# Altium schematic sheet Top_Level.SchDoc
size D
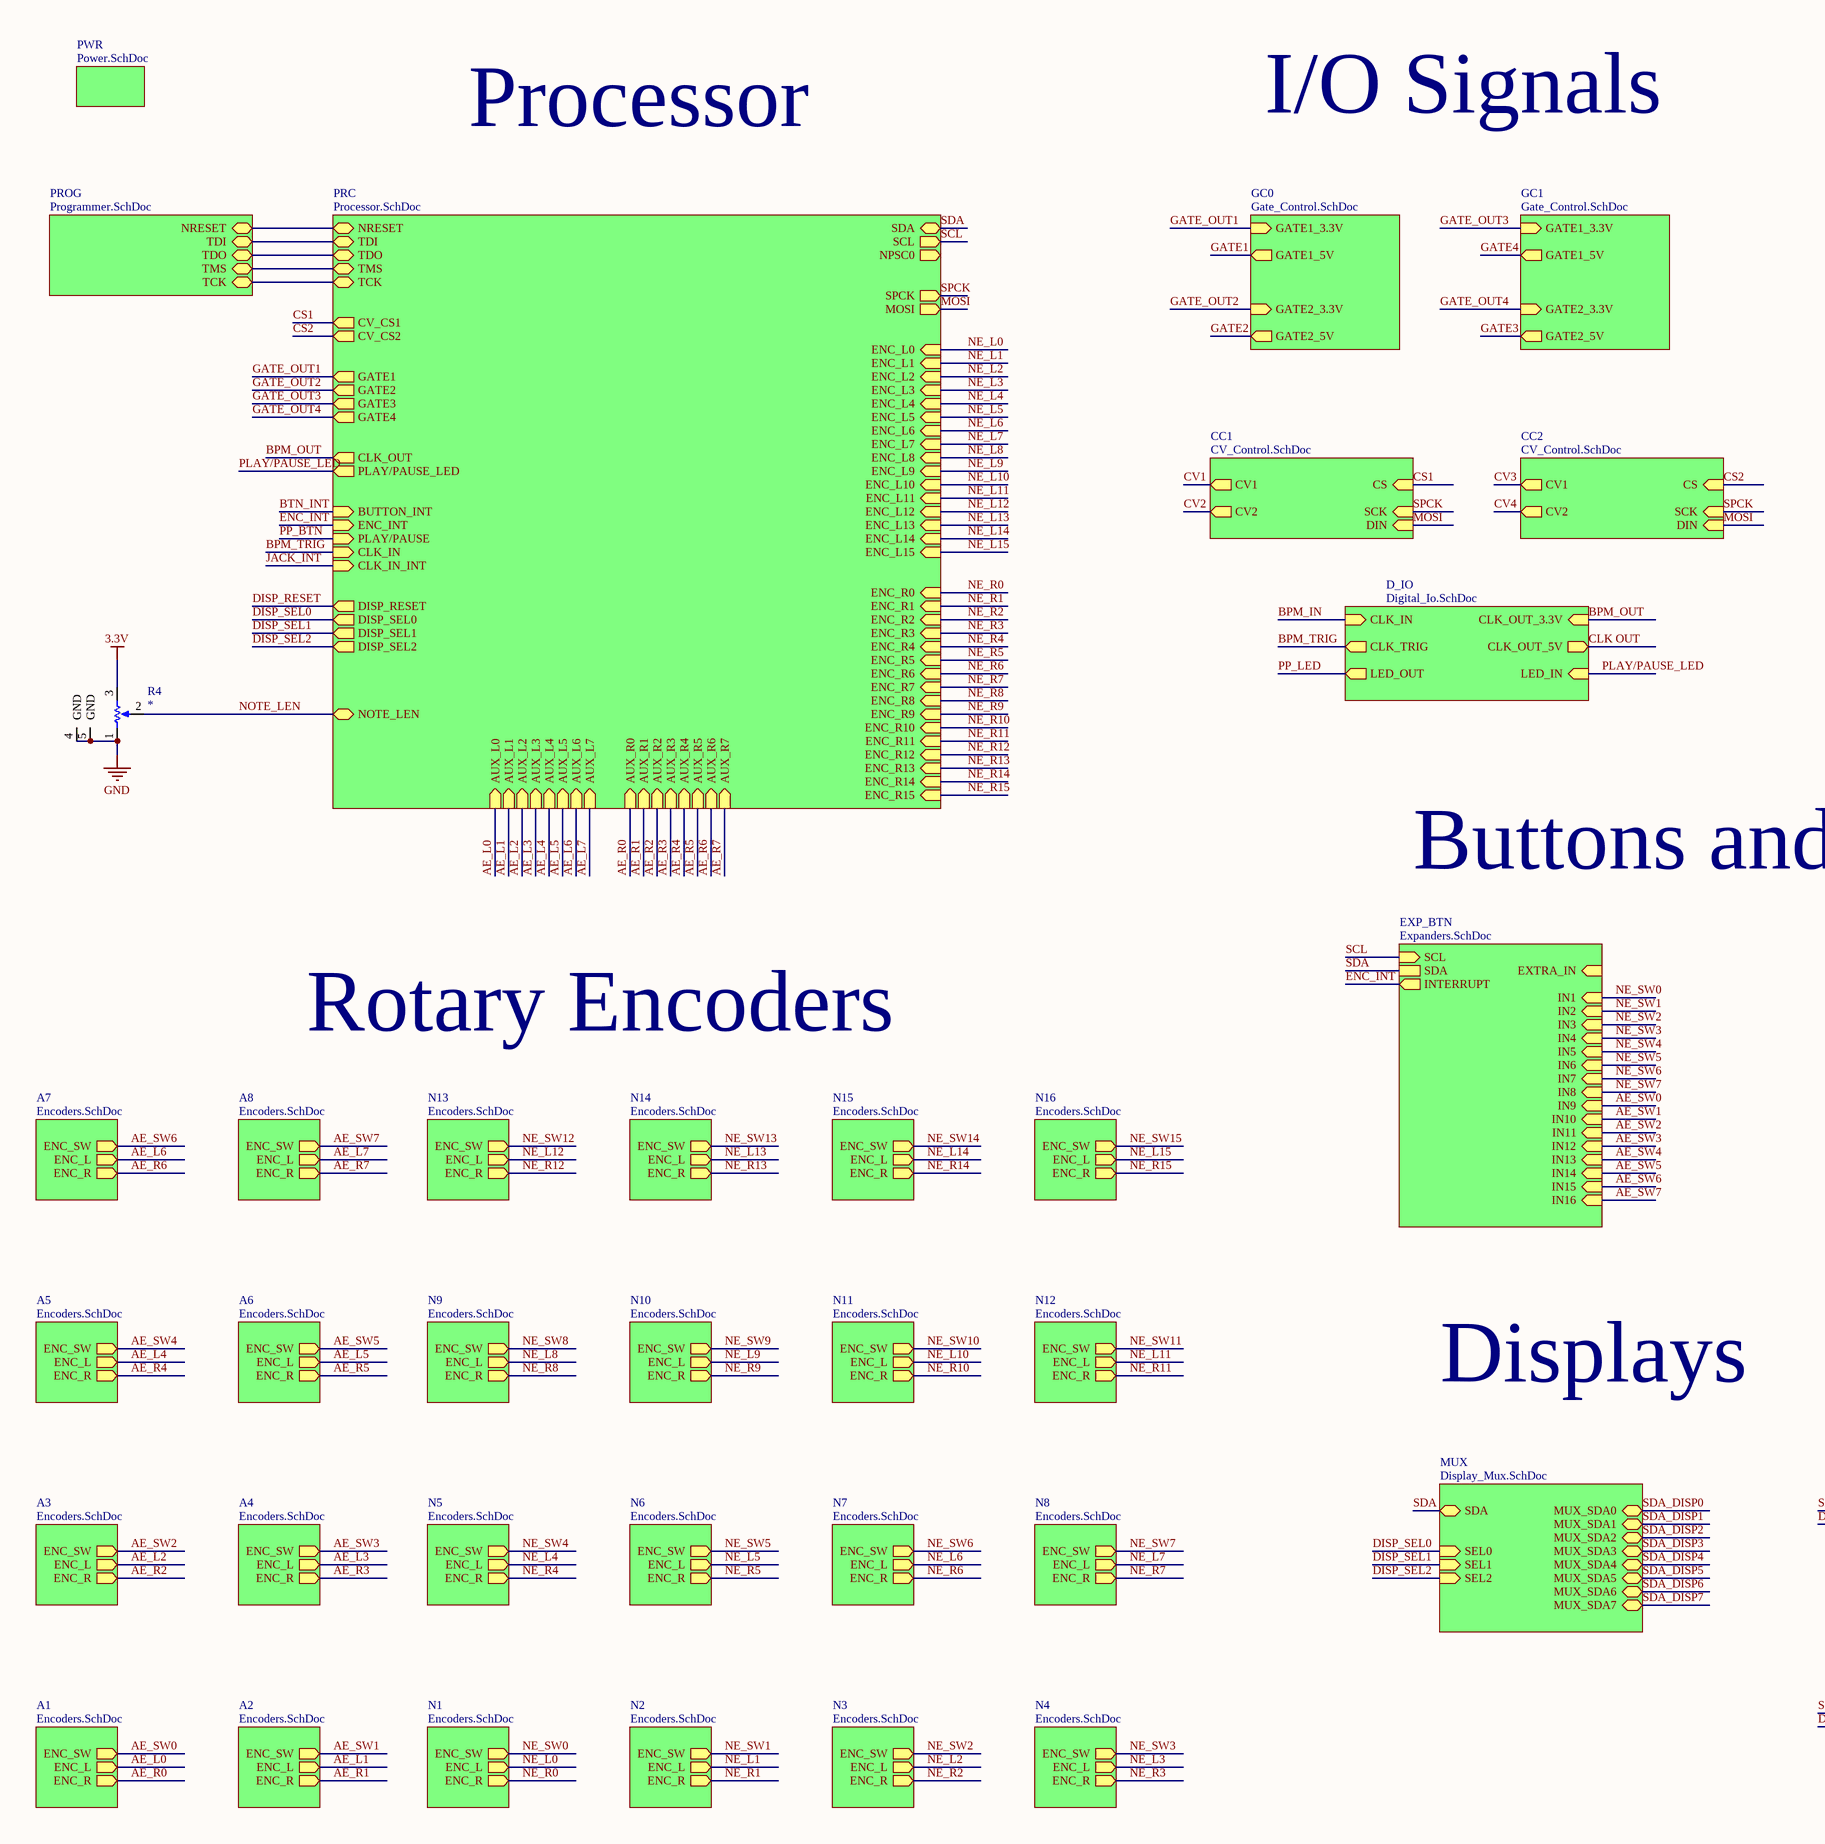
[diagram p0: Top_Level.SchDoc, left]
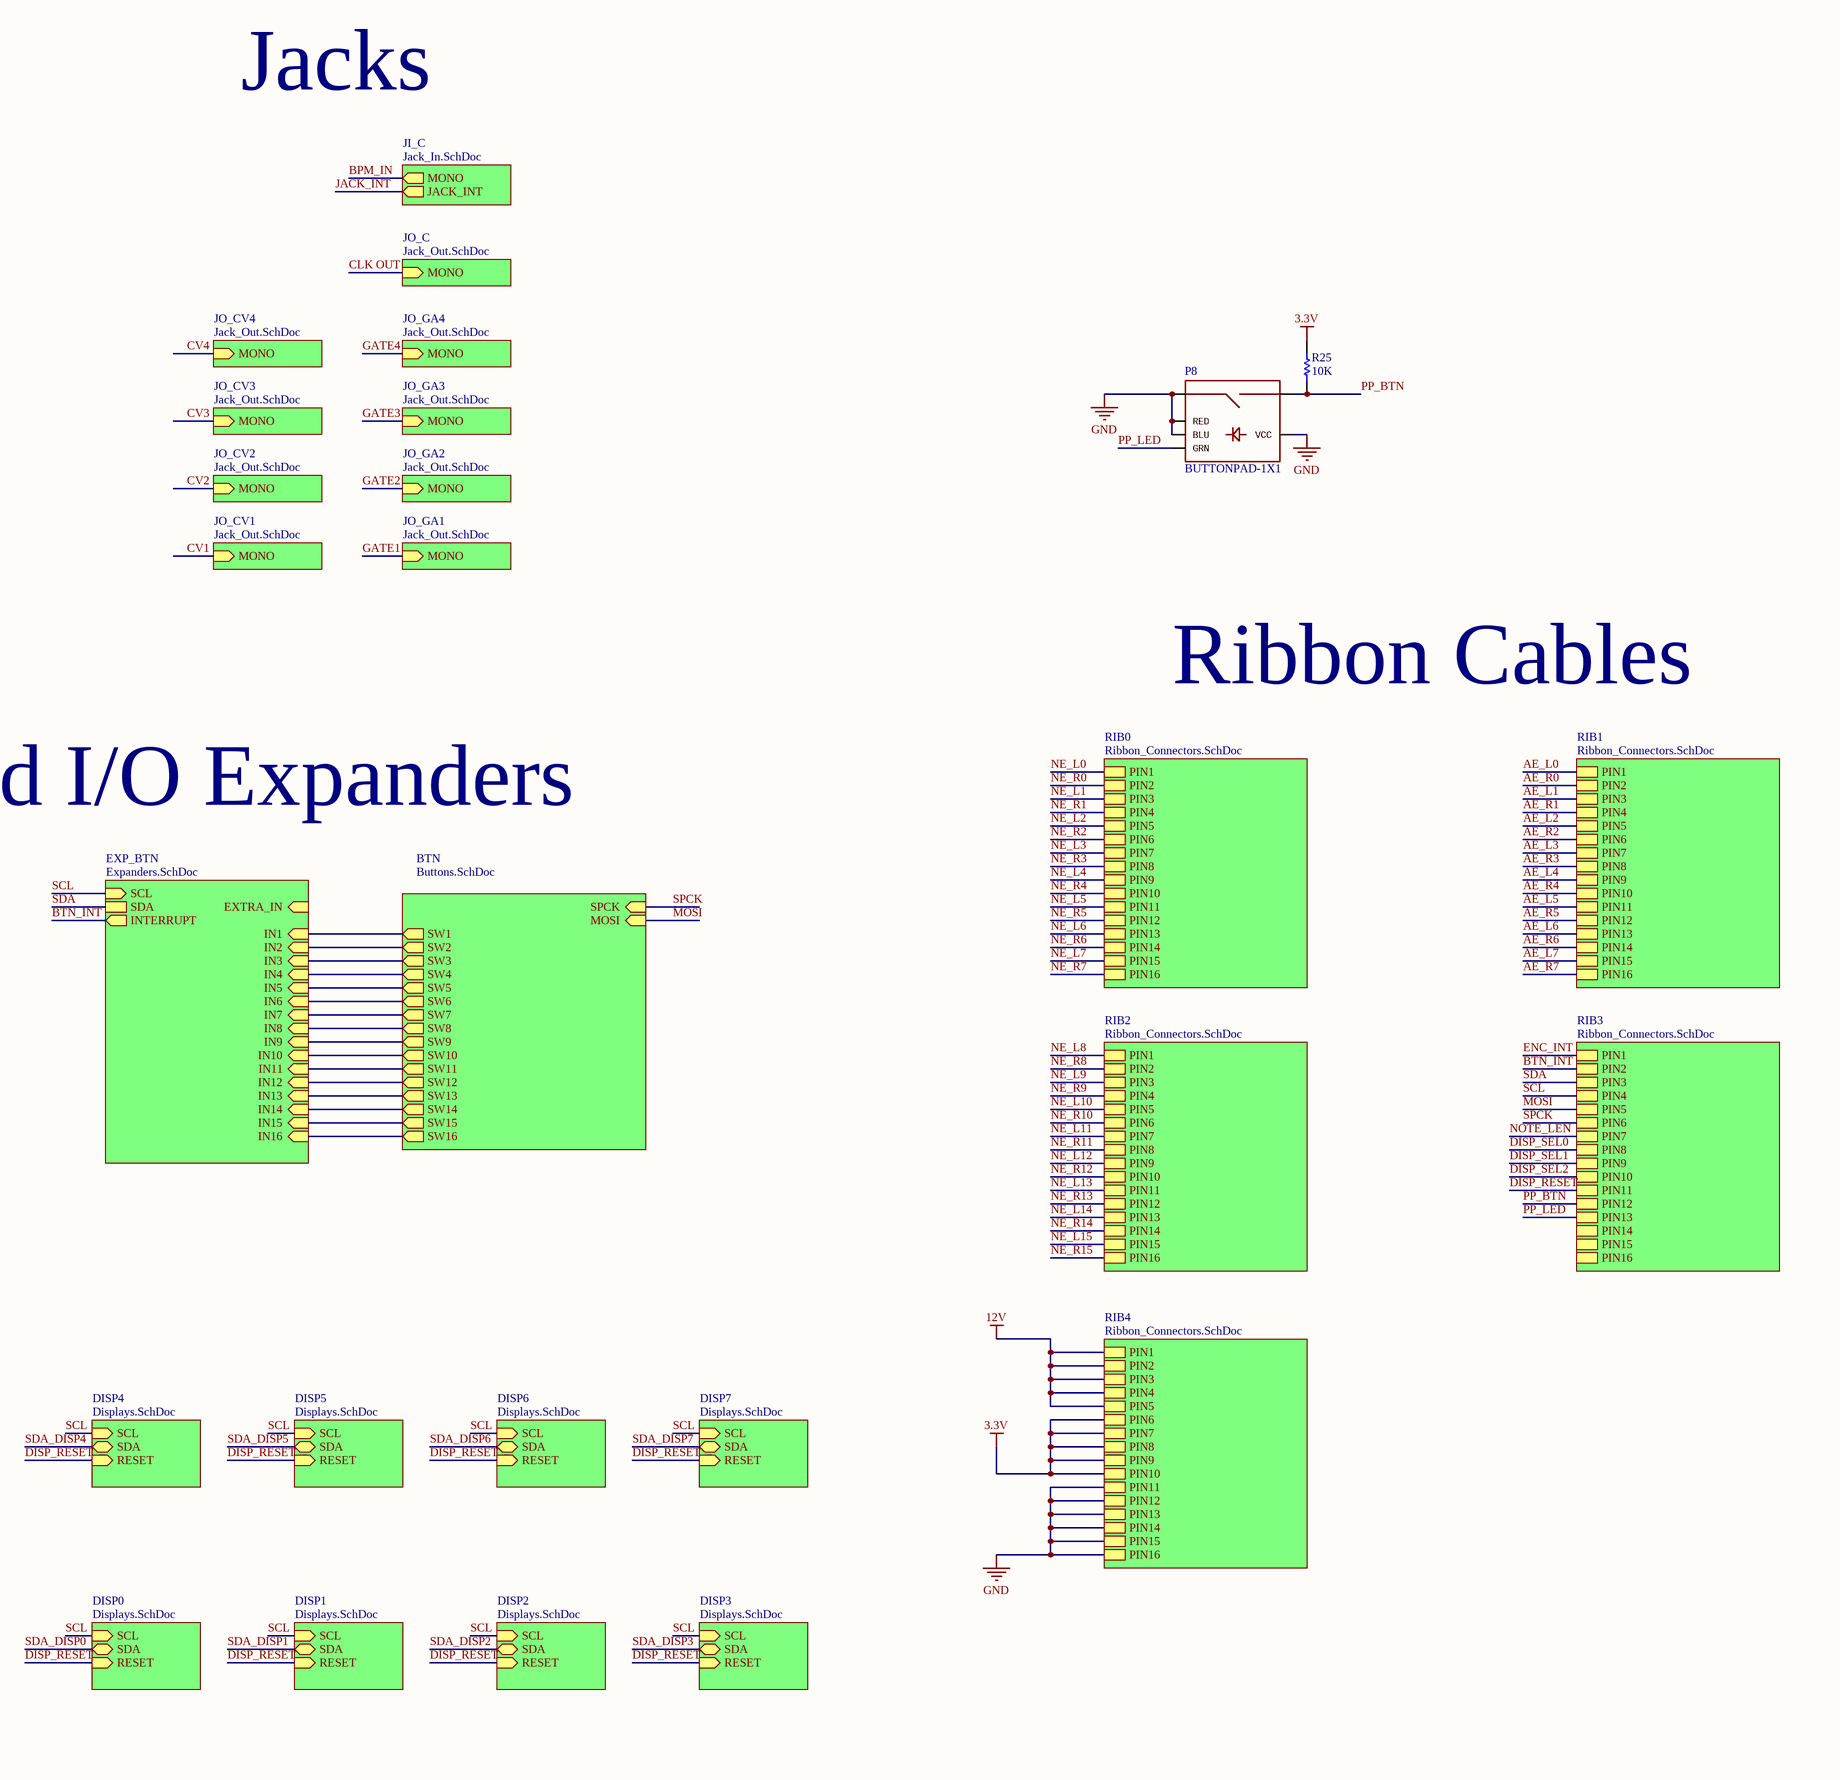
[diagram p1: Top_Level.SchDoc, right]

## Parts
P8  BUTTONPAD-1X1  [BUTTONPAD-1X1]
R4  *  [Potentiometer (NO SLOT)]
R25  value 10K  [AXIAL-0.3]  (hidden comment: R3)

## Sub-sheets
A1 = Encoders.SchDoc: ENC_SW (out), ENC_L (out), ENC_R (out)
A2 = Encoders.SchDoc: ENC_SW (out), ENC_L (out), ENC_R (out)
A3 = Encoders.SchDoc: ENC_SW (out), ENC_L (out), ENC_R (out)
A4 = Encoders.SchDoc: ENC_SW (out), ENC_L (out), ENC_R (out)
A5 = Encoders.SchDoc: ENC_SW (out), ENC_L (out), ENC_R (out)
A6 = Encoders.SchDoc: ENC_SW (out), ENC_L (out), ENC_R (out)
A7 = Encoders.SchDoc: ENC_SW (out), ENC_L (out), ENC_R (out)
A8 = Encoders.SchDoc: ENC_SW (out), ENC_L (out), ENC_R (out)
BTN = Buttons.SchDoc: SPCK (in), MOSI (in), SW1 (out), SW2 (out), SW3 (out), SW4 (out), SW5 (out), SW6 (out), SW7 (out), SW8 (out), SW9 (out), SW10 (out), SW11 (out), SW12 (out), SW13 (out), SW14 (out), SW15 (out), SW16 (out)
CC1 = CV_Control.SchDoc: CS (in), SCK (in), DIN (in), CV1 (out), CV2 (out)
CC2 = CV_Control.SchDoc: CS (in), SCK (in), DIN (in), CV1 (out), CV2 (out)
D_IO = Digital_Io.SchDoc: CLK_IN (in), CLK_TRIG (out), LED_IN (in), CLK_OUT_3.3V (in), CLK_OUT_5V (out), LED_OUT (out)
DISP0 = Displays.SchDoc: SCL (in), SDA (bidir), RESET (in)
DISP1 = Displays.SchDoc: SCL (in), SDA (bidir), RESET (in)
DISP2 = Displays.SchDoc: SCL (in), SDA (bidir), RESET (in)
DISP3 = Displays.SchDoc: SCL (in), SDA (bidir), RESET (in)
DISP4 = Displays.SchDoc: SCL (in), SDA (bidir), RESET (in)
DISP5 = Displays.SchDoc: SCL (in), SDA (bidir), RESET (in)
DISP6 = Displays.SchDoc: SCL (in), SDA (bidir), RESET (in)
DISP7 = Displays.SchDoc: SCL (in), SDA (bidir), RESET (in)
EXP_BTN = Expanders.SchDoc: SCL (in), SDA, EXTRA_IN (in), INTERRUPT (out), IN1 (in), IN2 (in), IN3 (in), IN4 (in), IN5 (in), IN6 (in), IN7 (in), IN8 (in), IN9 (in), IN10 (in), IN11 (in), IN12 (in), IN13 (in), IN14 (in), IN15 (in), IN16 (in)
EXP_BTN = Expanders.SchDoc: SCL (in), SDA, EXTRA_IN (in), INTERRUPT (out), IN1 (in), IN2 (in), IN3 (in), IN4 (in), IN5 (in), IN6 (in), IN7 (in), IN8 (in), IN9 (in), IN10 (in), IN11 (in), IN12 (in), IN13 (in), IN14 (in), IN15 (in), IN16 (in)
GC0 = Gate_Control.SchDoc: GATE1_3.3V (in), GATE2_3.3V (in), GATE1_5V (out), GATE2_5V (out)
GC1 = Gate_Control.SchDoc: GATE1_3.3V (in), GATE2_3.3V (in), GATE1_5V (out), GATE2_5V (out)
JI_C = Jack_In.SchDoc: MONO (out), JACK_INT (out)
JO_C = Jack_Out.SchDoc: MONO (in)
JO_CV1 = Jack_Out.SchDoc: MONO (in)
JO_CV2 = Jack_Out.SchDoc: MONO (in)
JO_CV3 = Jack_Out.SchDoc: MONO (in)
JO_CV4 = Jack_Out.SchDoc: MONO (in)
JO_GA1 = Jack_Out.SchDoc: MONO (in)
JO_GA2 = Jack_Out.SchDoc: MONO (in)
JO_GA3 = Jack_Out.SchDoc: MONO (in)
JO_GA4 = Jack_Out.SchDoc: MONO (in)
MUX = Display_Mux.SchDoc: SEL1 (in), SEL2 (in), MUX_SDA0 (bidir), MUX_SDA1 (bidir), MUX_SDA2 (bidir), MUX_SDA3 (bidir), MUX_SDA4 (bidir), MUX_SDA5 (bidir), MUX_SDA6 (bidir), MUX_SDA7 (bidir), SDA (bidir), SEL0 (in)
N1 = Encoders.SchDoc: ENC_SW (out), ENC_L (out), ENC_R (out)
N2 = Encoders.SchDoc: ENC_SW (out), ENC_L (out), ENC_R (out)
N3 = Encoders.SchDoc: ENC_SW (out), ENC_L (out), ENC_R (out)
N4 = Encoders.SchDoc: ENC_SW (out), ENC_L (out), ENC_R (out)
N5 = Encoders.SchDoc: ENC_SW (out), ENC_L (out), ENC_R (out)
N6 = Encoders.SchDoc: ENC_SW (out), ENC_L (out), ENC_R (out)
N7 = Encoders.SchDoc: ENC_SW (out), ENC_L (out), ENC_R (out)
N8 = Encoders.SchDoc: ENC_SW (out), ENC_L (out), ENC_R (out)
N9 = Encoders.SchDoc: ENC_SW (out), ENC_L (out), ENC_R (out)
N10 = Encoders.SchDoc: ENC_SW (out), ENC_L (out), ENC_R (out)
N11 = Encoders.SchDoc: ENC_SW (out), ENC_L (out), ENC_R (out)
N12 = Encoders.SchDoc: ENC_SW (out), ENC_L (out), ENC_R (out)
N13 = Encoders.SchDoc: ENC_SW (out), ENC_L (out), ENC_R (out)
N14 = Encoders.SchDoc: ENC_SW (out), ENC_L (out), ENC_R (out)
N15 = Encoders.SchDoc: ENC_SW (out), ENC_L (out), ENC_R (out)
N16 = Encoders.SchDoc: ENC_SW (out), ENC_L (out), ENC_R (out)
PRC = Processor.SchDoc: MOSI (out), SPCK (out), NPSC0 (out), SDA (bidir), SCL (out), NRESET (bidir), TDI (bidir), TDO (bidir), TMS (bidir), TCK (bidir), GATE1 (out), GATE2 (out), GATE3 (out), GATE4 (out), BUTTON_INT (in), ENC_INT (in), PLAY/PAUSE (in), CLK_IN (in), CLK_IN_INT (in), CLK_OUT (out), DISP_RESET (out), PLAY/PAUSE_LED (out), CV_CS2 (out), CV_CS1 (out), AUX_L0 (in), AUX_L1 (in), AUX_L2 (in), AUX_L3 (in), AUX_L4 (in), AUX_L5 (in), AUX_L6 (in), AUX_L7 (in), AUX_R0 (in), AUX_R1 (in), AUX_R2 (in), AUX_R3 (in), AUX_R4 (in), AUX_R5 (in), AUX_R6 (in), AUX_R7 (in), DISP_SEL0 (out), DISP_SEL1 (out), DISP_SEL2 (out), ENC_L0 (in), ENC_L1 (in), ENC_L2 (in), ENC_L3 (in), ENC_L4 (in), ENC_L5 (in), ENC_L6 (in), ENC_L7 (in), ENC_L8 (in), ENC_L9 (in), ENC_L10 (in), ENC_L11 (in), ENC_L12 (in), ENC_L13 (in), ENC_L14 (in), ENC_L15 (in), ENC_R0 (in), ENC_R1 (in), ENC_R2 (in), ENC_R3 (in), ENC_R4 (in), ENC_R5 (in), ENC_R6 (in), ENC_R7 (in), ENC_R8 (in), ENC_R9 (in), ENC_R10 (in), ENC_R11 (in), ENC_R12 (in), ENC_R13 (in), ENC_R14 (in), ENC_R15 (in), NOTE_LEN
PROG = Programmer.SchDoc: TMS (bidir), TCK (bidir), TDO (bidir), TDI (bidir), NRESET (bidir)
PWR = Power.SchDoc: no entries
RIB0 = Ribbon_Connectors.SchDoc: PIN1, PIN2, PIN3, PIN4, PIN5, PIN6, PIN7, PIN8, PIN9, PIN10, PIN11, PIN12, PIN13, PIN14, PIN15, PIN16
RIB1 = Ribbon_Connectors.SchDoc: PIN1, PIN2, PIN3, PIN4, PIN5, PIN6, PIN7, PIN8, PIN9, PIN10, PIN11, PIN12, PIN13, PIN14, PIN15, PIN16
RIB2 = Ribbon_Connectors.SchDoc: PIN1, PIN2, PIN3, PIN4, PIN5, PIN6, PIN7, PIN8, PIN9, PIN10, PIN11, PIN12, PIN13, PIN14, PIN15, PIN16
RIB3 = Ribbon_Connectors.SchDoc: PIN1, PIN2, PIN3, PIN4, PIN5, PIN6, PIN7, PIN8, PIN9, PIN10, PIN11, PIN12, PIN13, PIN14, PIN15, PIN16
RIB4 = Ribbon_Connectors.SchDoc: PIN1, PIN2, PIN3, PIN4, PIN5, PIN6, PIN7, PIN8, PIN9, PIN10, PIN11, PIN12, PIN13, PIN14, PIN15, PIN16

## Nets
3.3V: R4.3(BOT) R25.2 ; sheet RIB4/PIN6, sheet RIB4/PIN7, sheet RIB4/PIN8, sheet RIB4/PIN9, sheet RIB4/PIN10
12V: sheet RIB4/PIN1, sheet RIB4/PIN2, sheet RIB4/PIN3, sheet RIB4/PIN4, sheet RIB4/PIN5
GND: P8.BLU1(BLU) P8.RED1(RED) P8.SIG1 P8.VCC1(VCC) R4.1(TOP) R4.4(GND) R4.5(GND) ; sheet RIB4/PIN11, sheet RIB4/PIN12, sheet RIB4/PIN13, sheet RIB4/PIN14, sheet RIB4/PIN15, sheet RIB4/PIN16
AE_L0: sheet PRC/AUX_L0, sheet RIB1/PIN1, sheet A1/ENC_L
AE_L1: sheet PRC/AUX_L1, sheet RIB1/PIN3, sheet A2/ENC_L
AE_L2: sheet PRC/AUX_L2, sheet RIB1/PIN5, sheet A3/ENC_L
AE_L3: sheet PRC/AUX_L3, sheet RIB1/PIN7, sheet A4/ENC_L
AE_L4: sheet PRC/AUX_L4, sheet RIB1/PIN9, sheet A5/ENC_L
AE_L5: sheet PRC/AUX_L5, sheet RIB1/PIN11, sheet A6/ENC_L
AE_L6: sheet PRC/AUX_L6, sheet RIB1/PIN13, sheet A7/ENC_L
AE_L7: sheet PRC/AUX_L7, sheet RIB1/PIN15, sheet A8/ENC_L
AE_R0: sheet PRC/AUX_R0, sheet RIB1/PIN2, sheet A1/ENC_R
AE_R1: sheet PRC/AUX_R1, sheet RIB1/PIN4, sheet A2/ENC_R
AE_R2: sheet PRC/AUX_R2, sheet RIB1/PIN6, sheet A3/ENC_R
AE_R3: sheet PRC/AUX_R3, sheet RIB1/PIN8, sheet A4/ENC_R
AE_R4: sheet PRC/AUX_R4, sheet RIB1/PIN10, sheet A5/ENC_R
AE_R5: sheet PRC/AUX_R5, sheet RIB1/PIN12, sheet A6/ENC_R
AE_R6: sheet PRC/AUX_R6, sheet RIB1/PIN14, sheet A7/ENC_R
AE_R7: sheet PRC/AUX_R7, sheet RIB1/PIN16, sheet A8/ENC_R
AE_SW0: sheet EXP_BTN/IN9, sheet A1/ENC_SW
AE_SW1: sheet EXP_BTN/IN10, sheet A2/ENC_SW
AE_SW2: sheet EXP_BTN/IN11, sheet A3/ENC_SW
AE_SW3: sheet EXP_BTN/IN12, sheet A4/ENC_SW
AE_SW4: sheet EXP_BTN/IN13, sheet A5/ENC_SW
AE_SW5: sheet EXP_BTN/IN14, sheet A6/ENC_SW
AE_SW6: sheet EXP_BTN/IN15, sheet A7/ENC_SW
AE_SW7: sheet EXP_BTN/IN16, sheet A8/ENC_SW
BPM_IN: sheet JI_C/MONO, sheet D_IO/CLK_IN
BPM_OUT: sheet PRC/CLK_OUT, sheet D_IO/CLK_OUT_3.3V
BPM_TRIG: sheet PRC/CLK_IN, sheet D_IO/CLK_TRIG
BTN_INT: sheet PRC/BUTTON_INT, sheet EXP_BTN/INTERRUPT, sheet RIB3/PIN2
CLK OUT: sheet D_IO/CLK_OUT_5V, sheet JO_C/MONO
CS1: sheet PRC/CV_CS1, sheet CC1/CS
CS2: sheet PRC/CV_CS2, sheet CC2/CS
CV1: sheet CC1/CV1, sheet JO_CV1/MONO
CV2: sheet CC1/CV2, sheet JO_CV2/MONO
CV3: sheet CC2/CV1, sheet JO_CV3/MONO
CV4: sheet CC2/CV2, sheet JO_CV4/MONO
DISP_RESET: sheet PRC/DISP_RESET, sheet RIB3/PIN11, sheet DISP0/RESET, sheet DISP1/RESET, sheet DISP2/RESET, sheet DISP3/RESET, sheet DISP4/RESET, sheet DISP5/RESET, sheet DISP6/RESET, sheet DISP7/RESET
DISP_SEL0: sheet PRC/DISP_SEL0, sheet MUX/SEL0, sheet RIB3/PIN8
DISP_SEL1: sheet PRC/DISP_SEL1, sheet MUX/SEL1, sheet RIB3/PIN9
DISP_SEL2: sheet PRC/DISP_SEL2, sheet MUX/SEL2, sheet RIB3/PIN10
ENC_INT: sheet PRC/ENC_INT, sheet EXP_BTN/INTERRUPT, sheet RIB3/PIN1
GATE1: sheet GC0/GATE1_5V, sheet JO_GA1/MONO
GATE2: sheet GC0/GATE2_5V, sheet JO_GA2/MONO
GATE3: sheet GC1/GATE2_5V, sheet JO_GA3/MONO
GATE4: sheet GC1/GATE1_5V, sheet JO_GA4/MONO
GATE_OUT1: sheet PRC/GATE1, sheet GC0/GATE1_3.3V
GATE_OUT2: sheet PRC/GATE2, sheet GC0/GATE2_3.3V
GATE_OUT3: sheet GC1/GATE1_3.3V, sheet PRC/GATE3
GATE_OUT4: sheet GC1/GATE2_3.3V, sheet PRC/GATE4
JACK_INT: sheet PRC/CLK_IN_INT, sheet JI_C/JACK_INT
MOSI: sheet PRC/MOSI, sheet BTN/MOSI, sheet CC1/DIN, sheet CC2/DIN, sheet RIB3/PIN5
NE_L0: sheet PRC/ENC_L0, sheet RIB0/PIN1, sheet N1/ENC_L
NE_L1: sheet PRC/ENC_L1, sheet RIB0/PIN3, sheet N2/ENC_L
NE_L2: sheet PRC/ENC_L2, sheet RIB0/PIN5, sheet N3/ENC_L
NE_L3: sheet PRC/ENC_L3, sheet RIB0/PIN7, sheet N4/ENC_L
NE_L4: sheet PRC/ENC_L4, sheet RIB0/PIN9, sheet N5/ENC_L
NE_L5: sheet PRC/ENC_L5, sheet RIB0/PIN11, sheet N6/ENC_L
NE_L6: sheet PRC/ENC_L6, sheet RIB0/PIN13, sheet N7/ENC_L
NE_L7: sheet PRC/ENC_L7, sheet RIB0/PIN15, sheet N8/ENC_L
NE_L8: sheet PRC/ENC_L8, sheet RIB2/PIN1, sheet N9/ENC_L
NE_L9: sheet PRC/ENC_L9, sheet RIB2/PIN3, sheet N10/ENC_L
NE_L10: sheet PRC/ENC_L10, sheet RIB2/PIN5, sheet N11/ENC_L
NE_L11: sheet PRC/ENC_L11, sheet RIB2/PIN7, sheet N12/ENC_L
NE_L12: sheet PRC/ENC_L12, sheet RIB2/PIN9, sheet N13/ENC_L
NE_L13: sheet PRC/ENC_L13, sheet RIB2/PIN11, sheet N14/ENC_L
NE_L14: sheet PRC/ENC_L14, sheet RIB2/PIN13, sheet N15/ENC_L
NE_L15: sheet PRC/ENC_L15, sheet RIB2/PIN15, sheet N16/ENC_L
NE_R0: sheet PRC/ENC_R0, sheet RIB0/PIN2, sheet N1/ENC_R
NE_R1: sheet PRC/ENC_R1, sheet RIB0/PIN4, sheet N2/ENC_R
NE_R2: sheet PRC/ENC_R2, sheet RIB0/PIN6, sheet N3/ENC_R
NE_R3: sheet PRC/ENC_R3, sheet RIB0/PIN8, sheet N4/ENC_R
NE_R4: sheet PRC/ENC_R4, sheet RIB0/PIN10, sheet N5/ENC_R
NE_R5: sheet PRC/ENC_R5, sheet RIB0/PIN12, sheet N6/ENC_R
NE_R6: sheet PRC/ENC_R6, sheet RIB0/PIN14, sheet N7/ENC_R
NE_R7: sheet PRC/ENC_R7, sheet RIB0/PIN16, sheet N8/ENC_R
NE_R8: sheet PRC/ENC_R8, sheet RIB2/PIN2, sheet N9/ENC_R
NE_R9: sheet PRC/ENC_R9, sheet RIB2/PIN4, sheet N10/ENC_R
NE_R10: sheet PRC/ENC_R10, sheet RIB2/PIN6, sheet N11/ENC_R
NE_R11: sheet PRC/ENC_R11, sheet RIB2/PIN8, sheet N12/ENC_R
NE_R12: sheet PRC/ENC_R12, sheet RIB2/PIN10, sheet N13/ENC_R
NE_R13: sheet PRC/ENC_R13, sheet RIB2/PIN12, sheet N14/ENC_R
NE_R14: sheet PRC/ENC_R14, sheet RIB2/PIN14, sheet N15/ENC_R
NE_R15: sheet PRC/ENC_R15, sheet RIB2/PIN16, sheet N16/ENC_R
NE_SW0: sheet EXP_BTN/IN1, sheet N1/ENC_SW
NE_SW1: sheet EXP_BTN/IN2, sheet N2/ENC_SW
NE_SW2: sheet EXP_BTN/IN3, sheet N3/ENC_SW
NE_SW3: sheet EXP_BTN/IN4, sheet N4/ENC_SW
NE_SW4: sheet EXP_BTN/IN5, sheet N5/ENC_SW
NE_SW5: sheet EXP_BTN/IN6, sheet N6/ENC_SW
NE_SW6: sheet EXP_BTN/IN7, sheet N7/ENC_SW
NE_SW7: sheet EXP_BTN/IN8, sheet N8/ENC_SW
NE_SW8: sheet N9/ENC_SW
NE_SW9: sheet N10/ENC_SW
NE_SW10: sheet N11/ENC_SW
NE_SW11: sheet N12/ENC_SW
NE_SW12: sheet N13/ENC_SW
NE_SW13: sheet N14/ENC_SW
NE_SW14: sheet N15/ENC_SW
NE_SW15: sheet N16/ENC_SW
NOTE_LEN: R4.2(TAP) ; sheet PRC/NOTE_LEN, sheet RIB3/PIN7
PLAY/PAUSE_LED: sheet PRC/PLAY/PAUSE_LED, sheet D_IO/LED_IN
PP_BTN: P8.SIG2 R25.1 ; sheet PRC/PLAY/PAUSE, sheet RIB3/PIN12
PP_LED: P8.GRN1(GRN) ; sheet D_IO/LED_OUT, sheet RIB3/PIN13
SCL: sheet PRC/SCL, sheet EXP_BTN/SCL, sheet EXP_BTN/SCL, sheet RIB3/PIN4, sheet DISP0/SCL, sheet DISP1/SCL, sheet DISP2/SCL, sheet DISP3/SCL, sheet DISP4/SCL, sheet DISP5/SCL, sheet DISP6/SCL, sheet DISP7/SCL
SDA: sheet PRC/SDA, sheet EXP_BTN/SDA, sheet EXP_BTN/SDA, sheet MUX/SDA, sheet RIB3/PIN3
SDA_DISP0: sheet MUX/MUX_SDA0, sheet DISP0/SDA
SDA_DISP1: sheet MUX/MUX_SDA1, sheet DISP1/SDA
SDA_DISP2: sheet MUX/MUX_SDA2, sheet DISP2/SDA
SDA_DISP3: sheet MUX/MUX_SDA3, sheet DISP3/SDA
SDA_DISP4: sheet MUX/MUX_SDA4, sheet DISP4/SDA
SDA_DISP5: sheet MUX/MUX_SDA5, sheet DISP5/SDA
SDA_DISP6: sheet MUX/MUX_SDA6, sheet DISP6/SDA
SDA_DISP7: sheet MUX/MUX_SDA7, sheet DISP7/SDA
SPCK: sheet PRC/SPCK, sheet BTN/SPCK, sheet CC1/SCK, sheet CC2/SCK, sheet RIB3/PIN6
(unnamed): sheet PROG/TMS, sheet PRC/TMS
(unnamed): sheet PROG/TCK, sheet PRC/TCK
(unnamed): sheet PROG/TDO, sheet PRC/TDO
(unnamed): sheet PROG/TDI, sheet PRC/TDI
(unnamed): sheet PROG/NRESET, sheet PRC/NRESET
(unnamed): sheet BTN/SW1, sheet EXP_BTN/IN1
(unnamed): sheet BTN/SW2, sheet EXP_BTN/IN2
(unnamed): sheet BTN/SW3, sheet EXP_BTN/IN3
(unnamed): sheet BTN/SW4, sheet EXP_BTN/IN4
(unnamed): sheet BTN/SW5, sheet EXP_BTN/IN5
(unnamed): sheet BTN/SW6, sheet EXP_BTN/IN6
(unnamed): sheet BTN/SW7, sheet EXP_BTN/IN7
(unnamed): sheet BTN/SW8, sheet EXP_BTN/IN8
(unnamed): sheet BTN/SW9, sheet EXP_BTN/IN9
(unnamed): sheet BTN/SW10, sheet EXP_BTN/IN10
(unnamed): sheet BTN/SW11, sheet EXP_BTN/IN11
(unnamed): sheet BTN/SW12, sheet EXP_BTN/IN12
(unnamed): sheet BTN/SW13, sheet EXP_BTN/IN13
(unnamed): sheet BTN/SW14, sheet EXP_BTN/IN14
(unnamed): sheet BTN/SW15, sheet EXP_BTN/IN15
(unnamed): sheet BTN/SW16, sheet EXP_BTN/IN16

## Notes on the sheet
- Processor
- I/O Signals
- Jacks
- Ribbon Cables
- Buttons and I/O Expanders
- Rotary Encoders
- Displays

## Library data of the parts
R4 = Potentiometer (NO_SLOTS)
R25 = Res1: Resistor; Published: 8-Jun-2000; LatestRevisionDate: 17-Jul-2002; LatestRevisionNote: Re-released for DXP Platform.; PackageReference: AXIAL-0.3; Publisher: Altium Limited; PackageDescription: Axial Device, Thru-Hole; 2 Leads; 0.3 in Pin Spacing